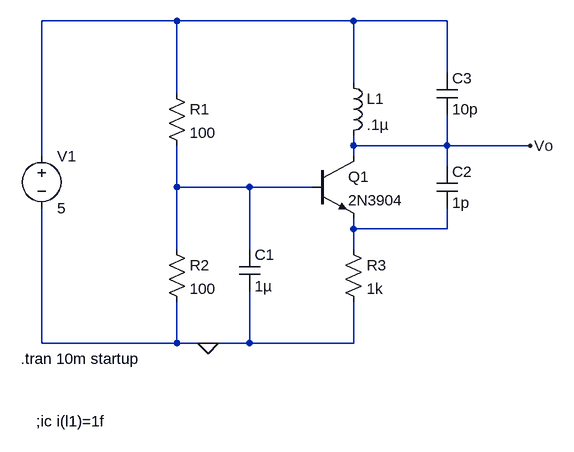
[diagram p0: schematic osc-bueno.asc]
osc-bueno.asc, the LTspice schematic file:
Version 4
SHEET 1 880 680
WIRE 64 -64 -144 -64
WIRE 336 -64 64 -64
WIRE 480 -64 336 -64
WIRE 480 16 480 -64
WIRE 336 32 336 -64
WIRE 64 48 64 -64
WIRE 336 128 336 112
WIRE 480 128 480 80
WIRE 480 128 336 128
WIRE 608 128 480 128
WIRE -144 144 -144 -64
WIRE 336 144 336 128
WIRE 480 160 480 128
WIRE 64 192 64 128
WIRE 176 192 64 192
WIRE 272 192 176 192
WIRE 336 256 336 240
WIRE 480 256 480 224
WIRE 480 256 336 256
WIRE 64 288 64 192
WIRE 176 288 176 192
WIRE 336 288 336 256
WIRE -144 432 -144 224
WIRE 64 432 64 368
WIRE 64 432 -144 432
WIRE 112 432 64 432
WIRE 176 432 176 352
WIRE 176 432 112 432
WIRE 336 432 336 368
WIRE 336 432 176 432
FLAG 112 432 0
FLAG 608 128 Vo
SYMBOL ind 320 16 R0
SYMATTR InstName L1
SYMATTR Value .1µ
SYMBOL res 48 32 R0
SYMATTR InstName R1
SYMATTR Value 100
SYMBOL res 48 272 R0
SYMATTR InstName R2
SYMATTR Value 100
SYMBOL cap 160 288 R0
SYMATTR InstName C1
SYMATTR Value 1µ
SYMBOL npn 272 144 R0
SYMATTR InstName Q1
SYMATTR Value 2N3904
SYMBOL res 320 272 R0
SYMATTR InstName R3
SYMATTR Value 1k
SYMBOL cap 464 160 R0
SYMATTR InstName C2
SYMATTR Value 1p
SYMBOL cap 464 16 R0
SYMATTR InstName C3
SYMATTR Value 10p
SYMBOL voltage -144 128 R0
WINDOW 123 0 0 Left 0
WINDOW 39 0 0 Left 0
SYMATTR InstName V1
SYMATTR Value 5
TEXT -176 456 Left 2 !.tran 10m startup
TEXT -152 552 Left 2 !;ic i(l1)=1f

The netlist it stands for:
* osc-bueno.asc
L1 N001 Vo .1µ
R1 N001 N002 100
R2 N002 0 100
C1 N002 0 1µ
Q1 Vo N002 N003 0 2N3904
R3 N003 0 1k
C2 Vo N003 1p
C3 N001 Vo 10p
V1 N001 0 5
.model NPN NPN
.model PNP PNP
.lib standard.bjt
.tran 10m startup
;ic i(l1)=1f
.backanno
.end